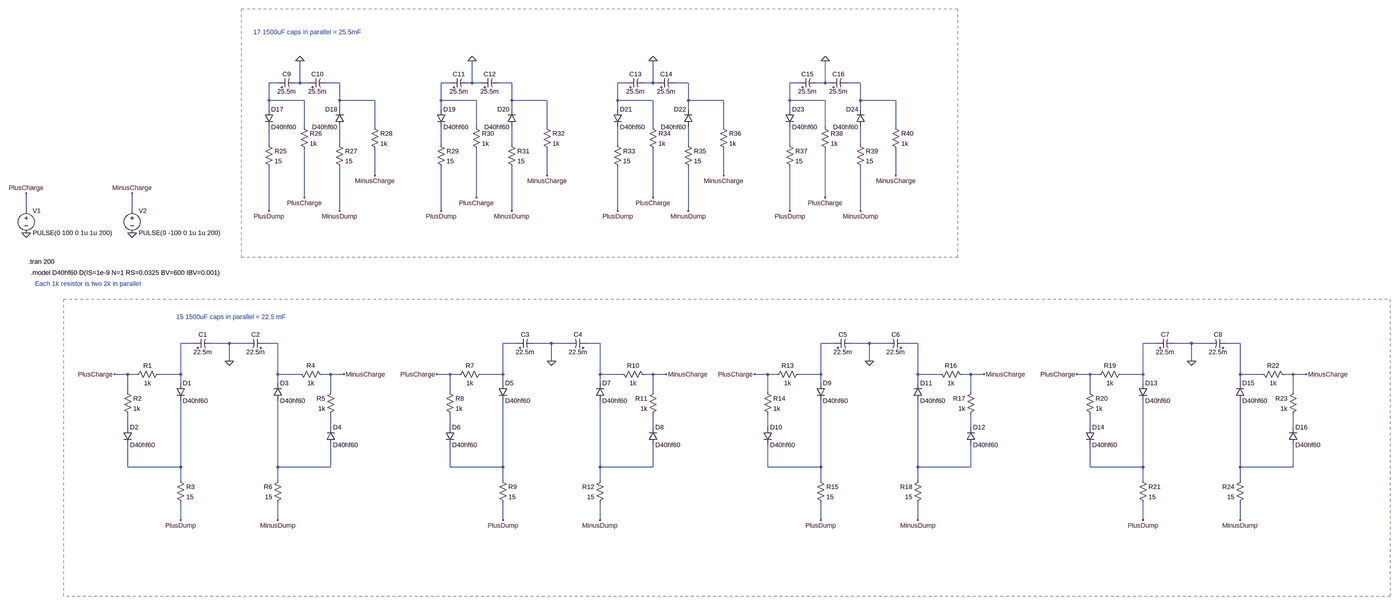
[diagram p0: schematic CapBank1_AllRacks.asc, whole sheet]
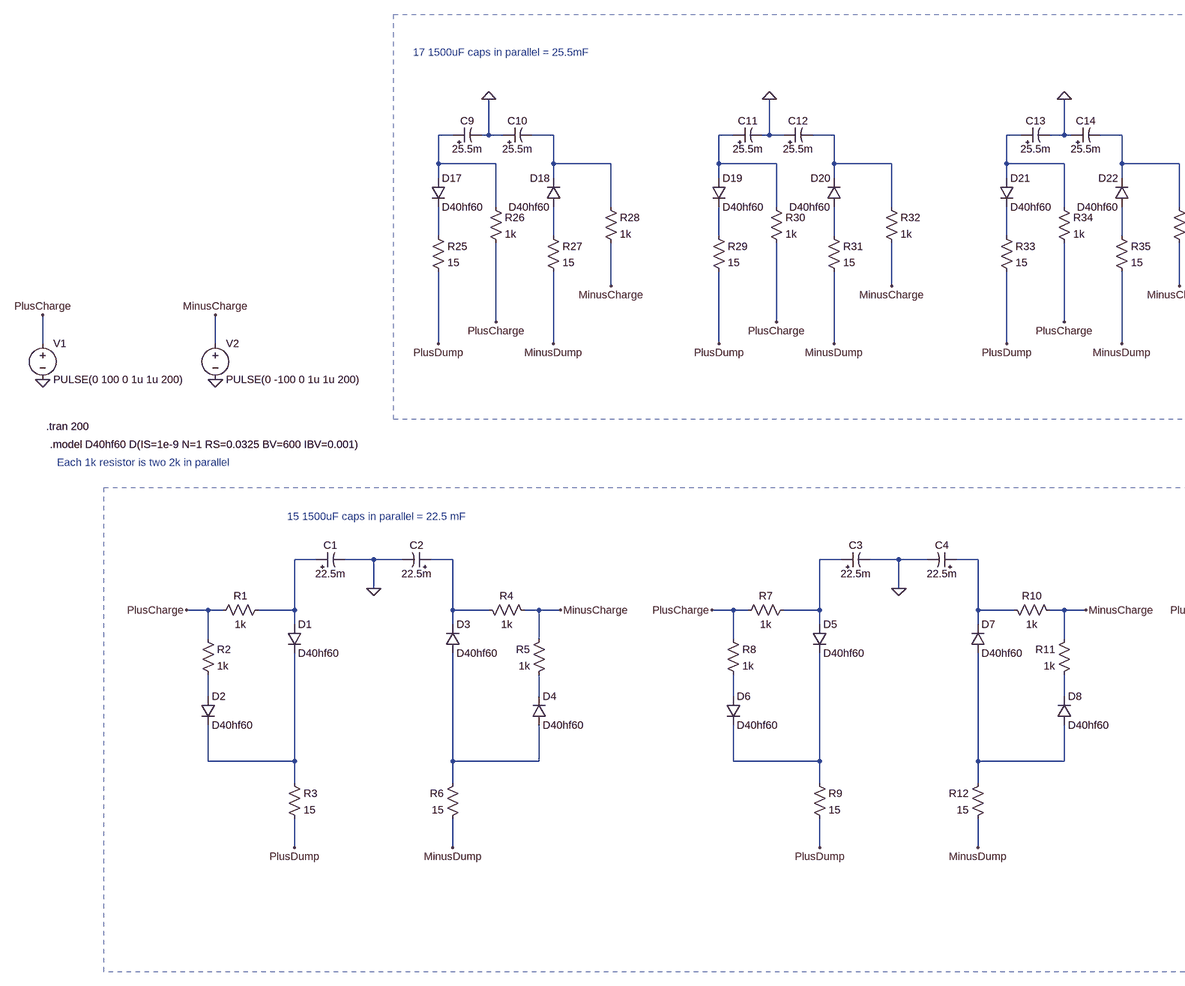
[diagram p1: schematic CapBank1_AllRacks.asc, part, row 1 of 1, column 1 of 2]
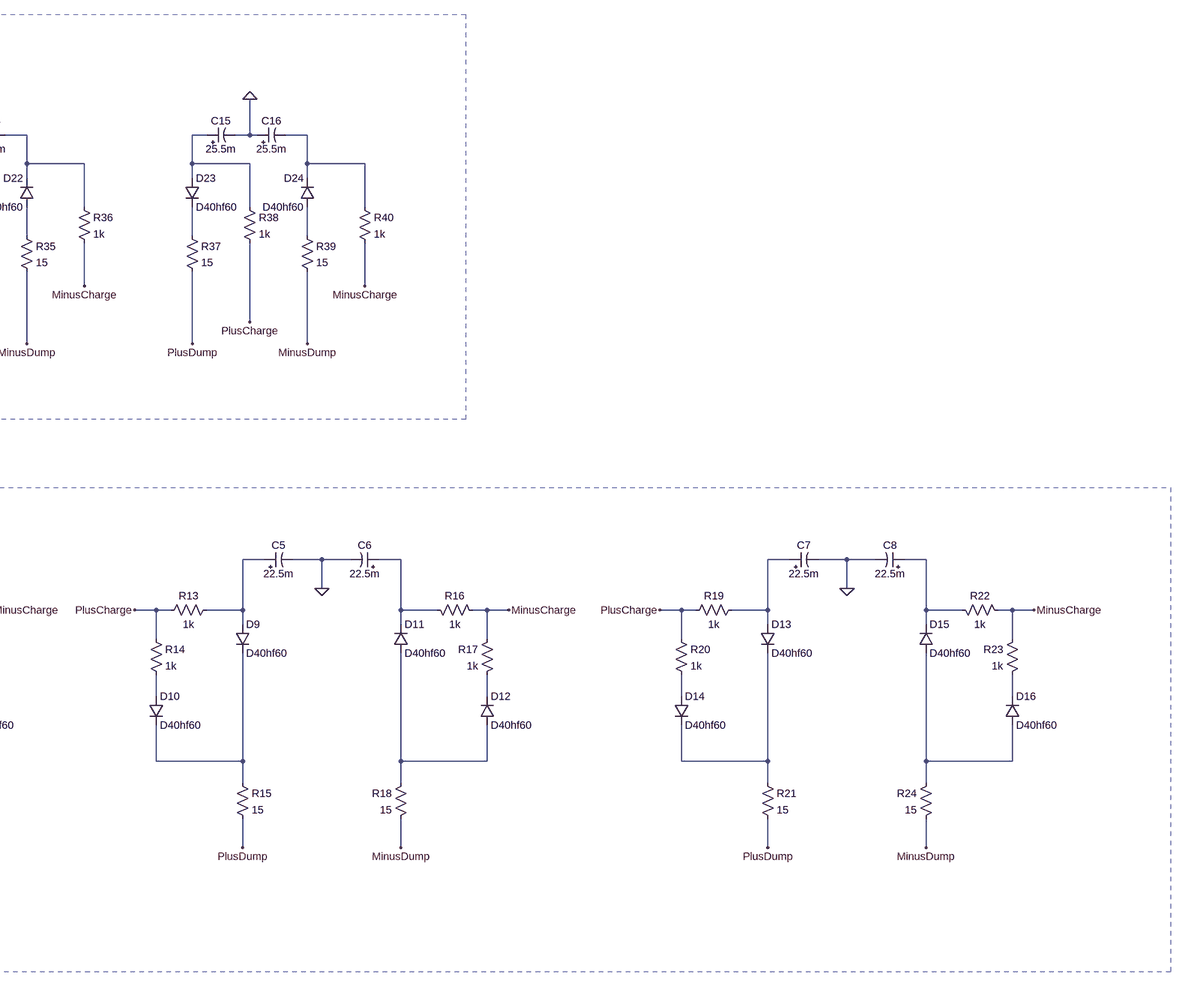
[diagram p2: schematic CapBank1_AllRacks.asc, part, row 1 of 1, column 2 of 2]
CapBank1_AllRacks.asc, the LTspice schematic file:
Version 4
SHEET 1 4340 1144
WIRE 304 -720 272 -720
WIRE 384 -720 384 -800
WIRE 384 -720 368 -720
WIRE 416 -720 384 -720
WIRE 528 -720 480 -720
WIRE 928 -720 896 -720
WIRE 1008 -720 1008 -800
WIRE 1008 -720 992 -720
WIRE 1040 -720 1008 -720
WIRE 1152 -720 1104 -720
WIRE 1568 -720 1536 -720
WIRE 1664 -720 1664 -800
WIRE 1664 -720 1632 -720
WIRE 1680 -720 1664 -720
WIRE 1792 -720 1744 -720
WIRE 2192 -720 2160 -720
WIRE 2288 -720 2288 -800
WIRE 2288 -720 2256 -720
WIRE 2304 -720 2288 -720
WIRE 2416 -720 2368 -720
WIRE 272 -656 272 -720
WIRE 400 -656 272 -656
WIRE 528 -656 528 -720
WIRE 656 -656 528 -656
WIRE 896 -656 896 -720
WIRE 1024 -656 896 -656
WIRE 1152 -656 1152 -720
WIRE 1280 -656 1152 -656
WIRE 1536 -656 1536 -720
WIRE 1664 -656 1536 -656
WIRE 1792 -656 1792 -720
WIRE 1920 -656 1792 -656
WIRE 2160 -656 2160 -720
WIRE 2288 -656 2160 -656
WIRE 2416 -656 2416 -720
WIRE 2544 -656 2416 -656
WIRE 272 -624 272 -656
WIRE 528 -624 528 -656
WIRE 896 -624 896 -656
WIRE 1152 -624 1152 -656
WIRE 1536 -624 1536 -656
WIRE 1792 -624 1792 -656
WIRE 2160 -624 2160 -656
WIRE 2416 -624 2416 -656
WIRE 400 -560 400 -656
WIRE 656 -560 656 -656
WIRE 1024 -560 1024 -656
WIRE 1280 -560 1280 -656
WIRE 1664 -560 1664 -656
WIRE 1920 -560 1920 -656
WIRE 2288 -560 2288 -656
WIRE 2544 -560 2544 -656
WIRE 272 -496 272 -560
WIRE 528 -496 528 -560
WIRE 896 -496 896 -560
WIRE 1152 -496 1152 -560
WIRE 1536 -496 1536 -560
WIRE 1792 -496 1792 -560
WIRE 2160 -496 2160 -560
WIRE 2416 -496 2416 -560
WIRE 656 -384 656 -480
WIRE 1280 -384 1280 -480
WIRE 1920 -384 1920 -480
WIRE 2544 -384 2544 -480
WIRE 400 -304 400 -480
WIRE 1024 -304 1024 -480
WIRE 1664 -304 1664 -480
WIRE 2288 -304 2288 -480
WIRE -608 -256 -608 -320
WIRE -224 -256 -224 -320
WIRE 272 -256 272 -416
WIRE 528 -256 528 -416
WIRE 896 -256 896 -416
WIRE 1152 -256 1152 -416
WIRE 1536 -256 1536 -416
WIRE 1792 -256 1792 -416
WIRE 2160 -256 2160 -416
WIRE 2416 -256 2416 -416
WIRE 0 224 -48 224
WIRE 128 224 64 224
WIRE 192 224 128 224
WIRE 304 224 256 224
WIRE 1168 224 1120 224
WIRE 1296 224 1232 224
WIRE 1360 224 1296 224
WIRE 1472 224 1424 224
WIRE 2320 224 2272 224
WIRE 2448 224 2384 224
WIRE 2512 224 2448 224
WIRE 2624 224 2576 224
WIRE 3488 224 3440 224
WIRE 3616 224 3552 224
WIRE 3680 224 3616 224
WIRE 3792 224 3744 224
WIRE 128 288 128 224
WIRE 1296 288 1296 224
WIRE 2448 288 2448 224
WIRE 3616 288 3616 224
WIRE -240 336 -288 336
WIRE -208 336 -240 336
WIRE -48 336 -48 224
WIRE -48 336 -128 336
WIRE 304 336 304 224
WIRE 384 336 304 336
WIRE 496 336 464 336
WIRE 544 336 496 336
WIRE 928 336 880 336
WIRE 960 336 928 336
WIRE 1120 336 1120 224
WIRE 1120 336 1040 336
WIRE 1472 336 1472 224
WIRE 1552 336 1472 336
WIRE 1664 336 1632 336
WIRE 1712 336 1664 336
WIRE 2080 336 2032 336
WIRE 2112 336 2080 336
WIRE 2272 336 2272 224
WIRE 2272 336 2192 336
WIRE 2624 336 2624 224
WIRE 2704 336 2624 336
WIRE 2816 336 2784 336
WIRE 2864 336 2816 336
WIRE 3248 336 3200 336
WIRE 3280 336 3248 336
WIRE 3440 336 3440 224
WIRE 3440 336 3360 336
WIRE 3792 336 3792 224
WIRE 3872 336 3792 336
WIRE 3984 336 3952 336
WIRE 4032 336 3984 336
WIRE -48 368 -48 336
WIRE 304 368 304 336
WIRE 1120 368 1120 336
WIRE 1472 368 1472 336
WIRE 2272 368 2272 336
WIRE 2624 368 2624 336
WIRE 3440 368 3440 336
WIRE 3792 368 3792 336
WIRE -240 400 -240 336
WIRE 496 400 496 336
WIRE 928 400 928 336
WIRE 1664 400 1664 336
WIRE 2080 400 2080 336
WIRE 2816 400 2816 336
WIRE 3248 400 3248 336
WIRE 3984 400 3984 336
WIRE -240 528 -240 480
WIRE 496 528 496 480
WIRE 928 528 928 480
WIRE 1664 528 1664 480
WIRE 2080 528 2080 480
WIRE 2816 528 2816 480
WIRE 3248 528 3248 480
WIRE 3984 528 3984 480
WIRE -240 672 -240 592
WIRE -48 672 -48 432
WIRE -48 672 -240 672
WIRE 304 672 304 432
WIRE 496 672 496 592
WIRE 496 672 304 672
WIRE 928 672 928 592
WIRE 1120 672 1120 432
WIRE 1120 672 928 672
WIRE 1472 672 1472 432
WIRE 1664 672 1664 592
WIRE 1664 672 1472 672
WIRE 2080 672 2080 592
WIRE 2272 672 2272 432
WIRE 2272 672 2080 672
WIRE 2624 672 2624 432
WIRE 2816 672 2816 592
WIRE 2816 672 2624 672
WIRE 3248 672 3248 592
WIRE 3440 672 3440 432
WIRE 3440 672 3248 672
WIRE 3792 672 3792 432
WIRE 3984 672 3984 592
WIRE 3984 672 3792 672
WIRE -48 720 -48 672
WIRE 304 720 304 672
WIRE 1120 720 1120 672
WIRE 1472 720 1472 672
WIRE 2272 720 2272 672
WIRE 2624 720 2624 672
WIRE 3440 720 3440 672
WIRE 3792 720 3792 672
WIRE -48 864 -48 800
WIRE 304 864 304 800
WIRE 1120 864 1120 800
WIRE 1472 864 1472 800
WIRE 2272 864 2272 800
WIRE 2624 864 2624 800
WIRE 3440 864 3440 800
WIRE 3792 864 3792 800
FLAG -288 336 PlusCharge
FLAG 128 288 0
FLAG -224 -176 0
FLAG -224 -320 MinusCharge
FLAG -608 -176 0
FLAG -608 -320 PlusCharge
FLAG -48 864 PlusDump
FLAG 544 336 MinusCharge
FLAG 304 864 MinusDump
FLAG 880 336 PlusCharge
FLAG 1296 288 0
FLAG 1120 864 PlusDump
FLAG 1712 336 MinusCharge
FLAG 1472 864 MinusDump
FLAG 2032 336 PlusCharge
FLAG 2448 288 0
FLAG 2272 864 PlusDump
FLAG 2864 336 MinusCharge
FLAG 2624 864 MinusDump
FLAG 3200 336 PlusCharge
FLAG 3616 288 0
FLAG 3440 864 PlusDump
FLAG 4032 336 MinusCharge
FLAG 3792 864 MinusDump
FLAG 272 -256 PlusDump
FLAG 896 -256 PlusDump
FLAG 1536 -256 PlusDump
FLAG 2160 -256 PlusDump
FLAG 528 -256 MinusDump
FLAG 1152 -256 MinusDump
FLAG 1792 -256 MinusDump
FLAG 2416 -256 MinusDump
FLAG 400 -304 PlusCharge
FLAG 1024 -304 PlusCharge
FLAG 1664 -304 PlusCharge
FLAG 2288 -304 PlusCharge
FLAG 656 -384 MinusCharge
FLAG 1280 -384 MinusCharge
FLAG 1920 -384 MinusCharge
FLAG 2544 -384 MinusCharge
FLAG 384 -800 0
FLAG 1008 -800 0
FLAG 1664 -800 0
FLAG 2288 -800 0
SYMBOL polcap 0 240 R270
WINDOW 0 32 32 VTop 2
WINDOW 3 0 32 VBottom 2
SYMATTR InstName C1
SYMATTR Value 22.5m
SYMBOL Diode -64 368 R0
SYMATTR InstName D1
SYMATTR Value D40hf60
SYMBOL Diode -256 528 R0
SYMATTR InstName D2
SYMATTR Value D40hf60
SYMBOL Res -112 320 R90
WINDOW 0 0 56 VBottom 2
WINDOW 3 32 56 VTop 2
SYMATTR InstName R1
SYMATTR Value 1k
SYMBOL Res -256 384 R0
SYMATTR InstName R2
SYMATTR Value 1k
SYMBOL Voltage -224 -272 R0
SYMATTR InstName V2
SYMATTR Value PULSE(0 -100 0 1u 1u 200)
SYMBOL Voltage -608 -272 R0
SYMATTR InstName V1
SYMATTR Value PULSE(0 100 0 1u 1u 200)
SYMBOL Res -64 704 R0
SYMATTR InstName R3
SYMATTR Value 15
SYMBOL polcap 256 240 M270
WINDOW 0 32 32 VTop 2
WINDOW 3 0 32 VBottom 2
SYMATTR InstName C2
SYMATTR Value 22.5m
SYMBOL Diode 288 432 M180
WINDOW 0 24 64 Left 2
WINDOW 3 24 0 Left 2
SYMATTR InstName D3
SYMATTR Value D40hf60
SYMBOL Diode 480 592 M180
WINDOW 0 24 64 Left 2
WINDOW 3 24 0 Left 2
SYMATTR InstName D4
SYMATTR Value D40hf60
SYMBOL Res 368 320 M90
WINDOW 0 0 56 VBottom 2
WINDOW 3 32 56 VTop 2
SYMATTR InstName R4
SYMATTR Value 1k
SYMBOL Res 512 384 M0
SYMATTR InstName R5
SYMATTR Value 1k
SYMBOL Res 320 704 M0
SYMATTR InstName R6
SYMATTR Value 15
SYMBOL polcap 1168 240 R270
WINDOW 0 32 32 VTop 2
WINDOW 3 0 32 VBottom 2
SYMATTR InstName C3
SYMATTR Value 22.5m
SYMBOL Diode 1104 368 R0
SYMATTR InstName D5
SYMATTR Value D40hf60
SYMBOL Diode 912 528 R0
SYMATTR InstName D6
SYMATTR Value D40hf60
SYMBOL Res 1056 320 R90
WINDOW 0 0 56 VBottom 2
WINDOW 3 32 56 VTop 2
SYMATTR InstName R7
SYMATTR Value 1k
SYMBOL Res 912 384 R0
SYMATTR InstName R8
SYMATTR Value 1k
SYMBOL Res 1104 704 R0
SYMATTR InstName R9
SYMATTR Value 15
SYMBOL polcap 1424 240 M270
WINDOW 0 32 32 VTop 2
WINDOW 3 0 32 VBottom 2
SYMATTR InstName C4
SYMATTR Value 22.5m
SYMBOL Diode 1456 432 M180
WINDOW 0 24 64 Left 2
WINDOW 3 24 0 Left 2
SYMATTR InstName D7
SYMATTR Value D40hf60
SYMBOL Diode 1648 592 M180
WINDOW 0 24 64 Left 2
WINDOW 3 24 0 Left 2
SYMATTR InstName D8
SYMATTR Value D40hf60
SYMBOL Res 1536 320 M90
WINDOW 0 0 56 VBottom 2
WINDOW 3 32 56 VTop 2
SYMATTR InstName R10
SYMATTR Value 1k
SYMBOL Res 1680 384 M0
SYMATTR InstName R11
SYMATTR Value 1k
SYMBOL Res 1488 704 M0
SYMATTR InstName R12
SYMATTR Value 15
SYMBOL polcap 2320 240 R270
WINDOW 0 32 32 VTop 2
WINDOW 3 0 32 VBottom 2
SYMATTR InstName C5
SYMATTR Value 22.5m
SYMBOL Diode 2256 368 R0
SYMATTR InstName D9
SYMATTR Value D40hf60
SYMBOL Diode 2064 528 R0
SYMATTR InstName D10
SYMATTR Value D40hf60
SYMBOL Res 2208 320 R90
WINDOW 0 0 56 VBottom 2
WINDOW 3 32 56 VTop 2
SYMATTR InstName R13
SYMATTR Value 1k
SYMBOL Res 2064 384 R0
SYMATTR InstName R14
SYMATTR Value 1k
SYMBOL Res 2256 704 R0
SYMATTR InstName R15
SYMATTR Value 15
SYMBOL polcap 2576 240 M270
WINDOW 0 32 32 VTop 2
WINDOW 3 0 32 VBottom 2
SYMATTR InstName C6
SYMATTR Value 22.5m
SYMBOL Diode 2608 432 M180
WINDOW 0 24 64 Left 2
WINDOW 3 24 0 Left 2
SYMATTR InstName D11
SYMATTR Value D40hf60
SYMBOL Diode 2800 592 M180
WINDOW 0 24 64 Left 2
WINDOW 3 24 0 Left 2
SYMATTR InstName D12
SYMATTR Value D40hf60
SYMBOL Res 2688 320 M90
WINDOW 0 0 56 VBottom 2
WINDOW 3 32 56 VTop 2
SYMATTR InstName R16
SYMATTR Value 1k
SYMBOL Res 2832 384 M0
SYMATTR InstName R17
SYMATTR Value 1k
SYMBOL Res 2640 704 M0
SYMATTR InstName R18
SYMATTR Value 15
SYMBOL polcap 3488 240 R270
WINDOW 0 32 32 VTop 2
WINDOW 3 0 32 VBottom 2
SYMATTR InstName C7
SYMATTR Value 22.5m
SYMBOL Diode 3424 368 R0
SYMATTR InstName D13
SYMATTR Value D40hf60
SYMBOL Diode 3232 528 R0
SYMATTR InstName D14
SYMATTR Value D40hf60
SYMBOL Res 3376 320 R90
WINDOW 0 0 56 VBottom 2
WINDOW 3 32 56 VTop 2
SYMATTR InstName R19
SYMATTR Value 1k
SYMBOL Res 3232 384 R0
SYMATTR InstName R20
SYMATTR Value 1k
SYMBOL Res 3424 704 R0
SYMATTR InstName R21
SYMATTR Value 15
SYMBOL polcap 3744 240 M270
WINDOW 0 32 32 VTop 2
WINDOW 3 0 32 VBottom 2
SYMATTR InstName C8
SYMATTR Value 22.5m
SYMBOL Diode 3776 432 M180
WINDOW 0 24 64 Left 2
WINDOW 3 24 0 Left 2
SYMATTR InstName D15
SYMATTR Value D40hf60
SYMBOL Diode 3968 592 M180
WINDOW 0 24 64 Left 2
WINDOW 3 24 0 Left 2
SYMATTR InstName D16
SYMATTR Value D40hf60
SYMBOL Res 3856 320 M90
WINDOW 0 0 56 VBottom 2
WINDOW 3 32 56 VTop 2
SYMATTR InstName R22
SYMATTR Value 1k
SYMBOL Res 4000 384 M0
SYMATTR InstName R23
SYMATTR Value 1k
SYMBOL Res 3808 704 M0
SYMATTR InstName R24
SYMATTR Value 15
SYMBOL polcap 304 -704 R270
WINDOW 0 32 32 VTop 2
WINDOW 3 0 32 VBottom 2
SYMATTR InstName C9
SYMATTR Value 25.5m
SYMBOL polcap 416 -704 R270
WINDOW 0 32 32 VTop 2
WINDOW 3 0 32 VBottom 2
SYMATTR InstName C10
SYMATTR Value 25.5m
SYMBOL Diode 256 -624 R0
SYMATTR InstName D17
SYMATTR Value D40hf60
SYMBOL Res 256 -512 R0
SYMATTR InstName R25
SYMATTR Value 15
SYMBOL Res 384 -576 R0
SYMATTR InstName R26
SYMATTR Value 1k
SYMBOL Diode 544 -560 R180
WINDOW 0 24 64 Left 2
WINDOW 3 24 0 Left 2
SYMATTR InstName D18
SYMATTR Value D40hf60
SYMBOL Res 512 -512 R0
SYMATTR InstName R27
SYMATTR Value 15
SYMBOL Res 640 -576 R0
SYMATTR InstName R28
SYMATTR Value 1k
SYMBOL polcap 928 -704 R270
WINDOW 0 32 32 VTop 2
WINDOW 3 0 32 VBottom 2
SYMATTR InstName C11
SYMATTR Value 25.5m
SYMBOL polcap 1040 -704 R270
WINDOW 0 32 32 VTop 2
WINDOW 3 0 32 VBottom 2
SYMATTR InstName C12
SYMATTR Value 25.5m
SYMBOL Diode 880 -624 R0
SYMATTR InstName D19
SYMATTR Value D40hf60
SYMBOL Res 880 -512 R0
SYMATTR InstName R29
SYMATTR Value 15
SYMBOL Res 1008 -576 R0
SYMATTR InstName R30
SYMATTR Value 1k
SYMBOL Diode 1168 -560 R180
WINDOW 0 24 64 Left 2
WINDOW 3 24 0 Left 2
SYMATTR InstName D20
SYMATTR Value D40hf60
SYMBOL Res 1136 -512 R0
SYMATTR InstName R31
SYMATTR Value 15
SYMBOL Res 1264 -576 R0
SYMATTR InstName R32
SYMATTR Value 1k
SYMBOL polcap 1568 -704 R270
WINDOW 0 32 32 VTop 2
WINDOW 3 0 32 VBottom 2
SYMATTR InstName C13
SYMATTR Value 25.5m
SYMBOL polcap 1680 -704 R270
WINDOW 0 32 32 VTop 2
WINDOW 3 0 32 VBottom 2
SYMATTR InstName C14
SYMATTR Value 25.5m
SYMBOL Diode 1520 -624 R0
SYMATTR InstName D21
SYMATTR Value D40hf60
SYMBOL Res 1520 -512 R0
SYMATTR InstName R33
SYMATTR Value 15
SYMBOL Res 1648 -576 R0
SYMATTR InstName R34
SYMATTR Value 1k
SYMBOL Diode 1808 -560 R180
WINDOW 0 24 64 Left 2
WINDOW 3 24 0 Left 2
SYMATTR InstName D22
SYMATTR Value D40hf60
SYMBOL Res 1776 -512 R0
SYMATTR InstName R35
SYMATTR Value 15
SYMBOL Res 1904 -576 R0
SYMATTR InstName R36
SYMATTR Value 1k
SYMBOL polcap 2192 -704 R270
WINDOW 0 32 32 VTop 2
WINDOW 3 0 32 VBottom 2
SYMATTR InstName C15
SYMATTR Value 25.5m
SYMBOL polcap 2304 -704 R270
WINDOW 0 32 32 VTop 2
WINDOW 3 0 32 VBottom 2
SYMATTR InstName C16
SYMATTR Value 25.5m
SYMBOL Diode 2144 -624 R0
SYMATTR InstName D23
SYMATTR Value D40hf60
SYMBOL Res 2144 -512 R0
SYMATTR InstName R37
SYMATTR Value 15
SYMBOL Res 2272 -576 R0
SYMATTR InstName R38
SYMATTR Value 1k
SYMBOL Diode 2432 -560 R180
WINDOW 0 24 64 Left 2
WINDOW 3 24 0 Left 2
SYMATTR InstName D24
SYMATTR Value D40hf60
SYMBOL Res 2400 -512 R0
SYMATTR InstName R39
SYMATTR Value 15
SYMBOL Res 2528 -576 R0
SYMATTR InstName R40
SYMATTR Value 1k
TEXT -592 -32 Left 2 !.model D40hf60 D(IS=1e-9 N=1 RS=0.0325 BV=600 IBV=0.001)
TEXT -600 -72 Left 2 !.tran 200
TEXT -576 8 Left 2 ;Each 1k resistor is two 2k in parallel
TEXT -64 128 Left 2 ;15 1500uF caps in parallel = 22.5 mF
TEXT 216 -904 Left 2 ;17 1500uF caps in parallel = 25.5mF
RECTANGLE Normal 172 -988 2768 -88 2
RECTANGLE Normal -472 64 4336 1140 2

The netlist it stands for:
* CapBank1_AllRacks.asc
C1 N017 0 22.5m
D1 N017 N033 D40hf60
D2 N025 N033 D40hf60
R1 N017 PlusCharge 1k
R2 PlusCharge N025 1k
V2 MinusCharge 0 PULSE(0 -100 0 1u 1u 200)
V1 PlusCharge 0 PULSE(0 100 0 1u 1u 200)
R3 N033 PlusDump 15
C2 N018 0 22.5m
D3 N034 N018 D40hf60
D4 N034 N026 D40hf60
R4 N018 MinusCharge 1k
R5 MinusCharge N026 1k
R6 N034 MinusDump 15
C3 N019 0 22.5m
D5 N019 N035 D40hf60
D6 N027 N035 D40hf60
R7 N019 PlusCharge 1k
R8 PlusCharge N027 1k
R9 N035 PlusDump 15
C4 N020 0 22.5m
D7 N036 N020 D40hf60
D8 N036 N028 D40hf60
R10 N020 MinusCharge 1k
R11 MinusCharge N028 1k
R12 N036 MinusDump 15
C5 N021 0 22.5m
D9 N021 N037 D40hf60
D10 N029 N037 D40hf60
R13 N021 PlusCharge 1k
R14 PlusCharge N029 1k
R15 N037 PlusDump 15
C6 N022 0 22.5m
D11 N038 N022 D40hf60
D12 N038 N030 D40hf60
R16 N022 MinusCharge 1k
R17 MinusCharge N030 1k
R18 N038 MinusDump 15
C7 N023 0 22.5m
D13 N023 N039 D40hf60
D14 N031 N039 D40hf60
R19 N023 PlusCharge 1k
R20 PlusCharge N031 1k
R21 N039 PlusDump 15
C8 N024 0 22.5m
D15 N040 N024 D40hf60
D16 N040 N032 D40hf60
R22 N024 MinusCharge 1k
R23 MinusCharge N032 1k
R24 N040 MinusDump 15
C9 N001 0 25.5m
C10 0 N002 25.5m
D17 N001 N009 D40hf60
R25 N009 PlusDump 15
R26 N001 PlusCharge 1k
D18 N010 N002 D40hf60
R27 N010 MinusDump 15
R28 N002 MinusCharge 1k
C11 N003 0 25.5m
C12 0 N004 25.5m
D19 N003 N011 D40hf60
R29 N011 PlusDump 15
R30 N003 PlusCharge 1k
D20 N012 N004 D40hf60
R31 N012 MinusDump 15
R32 N004 MinusCharge 1k
C13 N005 0 25.5m
C14 0 N006 25.5m
D21 N005 N013 D40hf60
R33 N013 PlusDump 15
R34 N005 PlusCharge 1k
D22 N014 N006 D40hf60
R35 N014 MinusDump 15
R36 N006 MinusCharge 1k
C15 N007 0 25.5m
C16 0 N008 25.5m
D23 N007 N015 D40hf60
R37 N015 PlusDump 15
R38 N007 PlusCharge 1k
D24 N016 N008 D40hf60
R39 N016 MinusDump 15
R40 N008 MinusCharge 1k
.model D D
.lib standard.dio
.model D40hf60 D(IS=1e-9 N=1 RS=0.0325 BV=600 IBV=0.001)
.tran 200
* Each 1k resistor is two 2k in parallel
* 15 1500uF caps in parallel = 22.5 mF
* 17 1500uF caps in parallel = 25.5mF
.backanno
.end